# EAGLE design grizzly_bear (EAGLE 6.5.0)
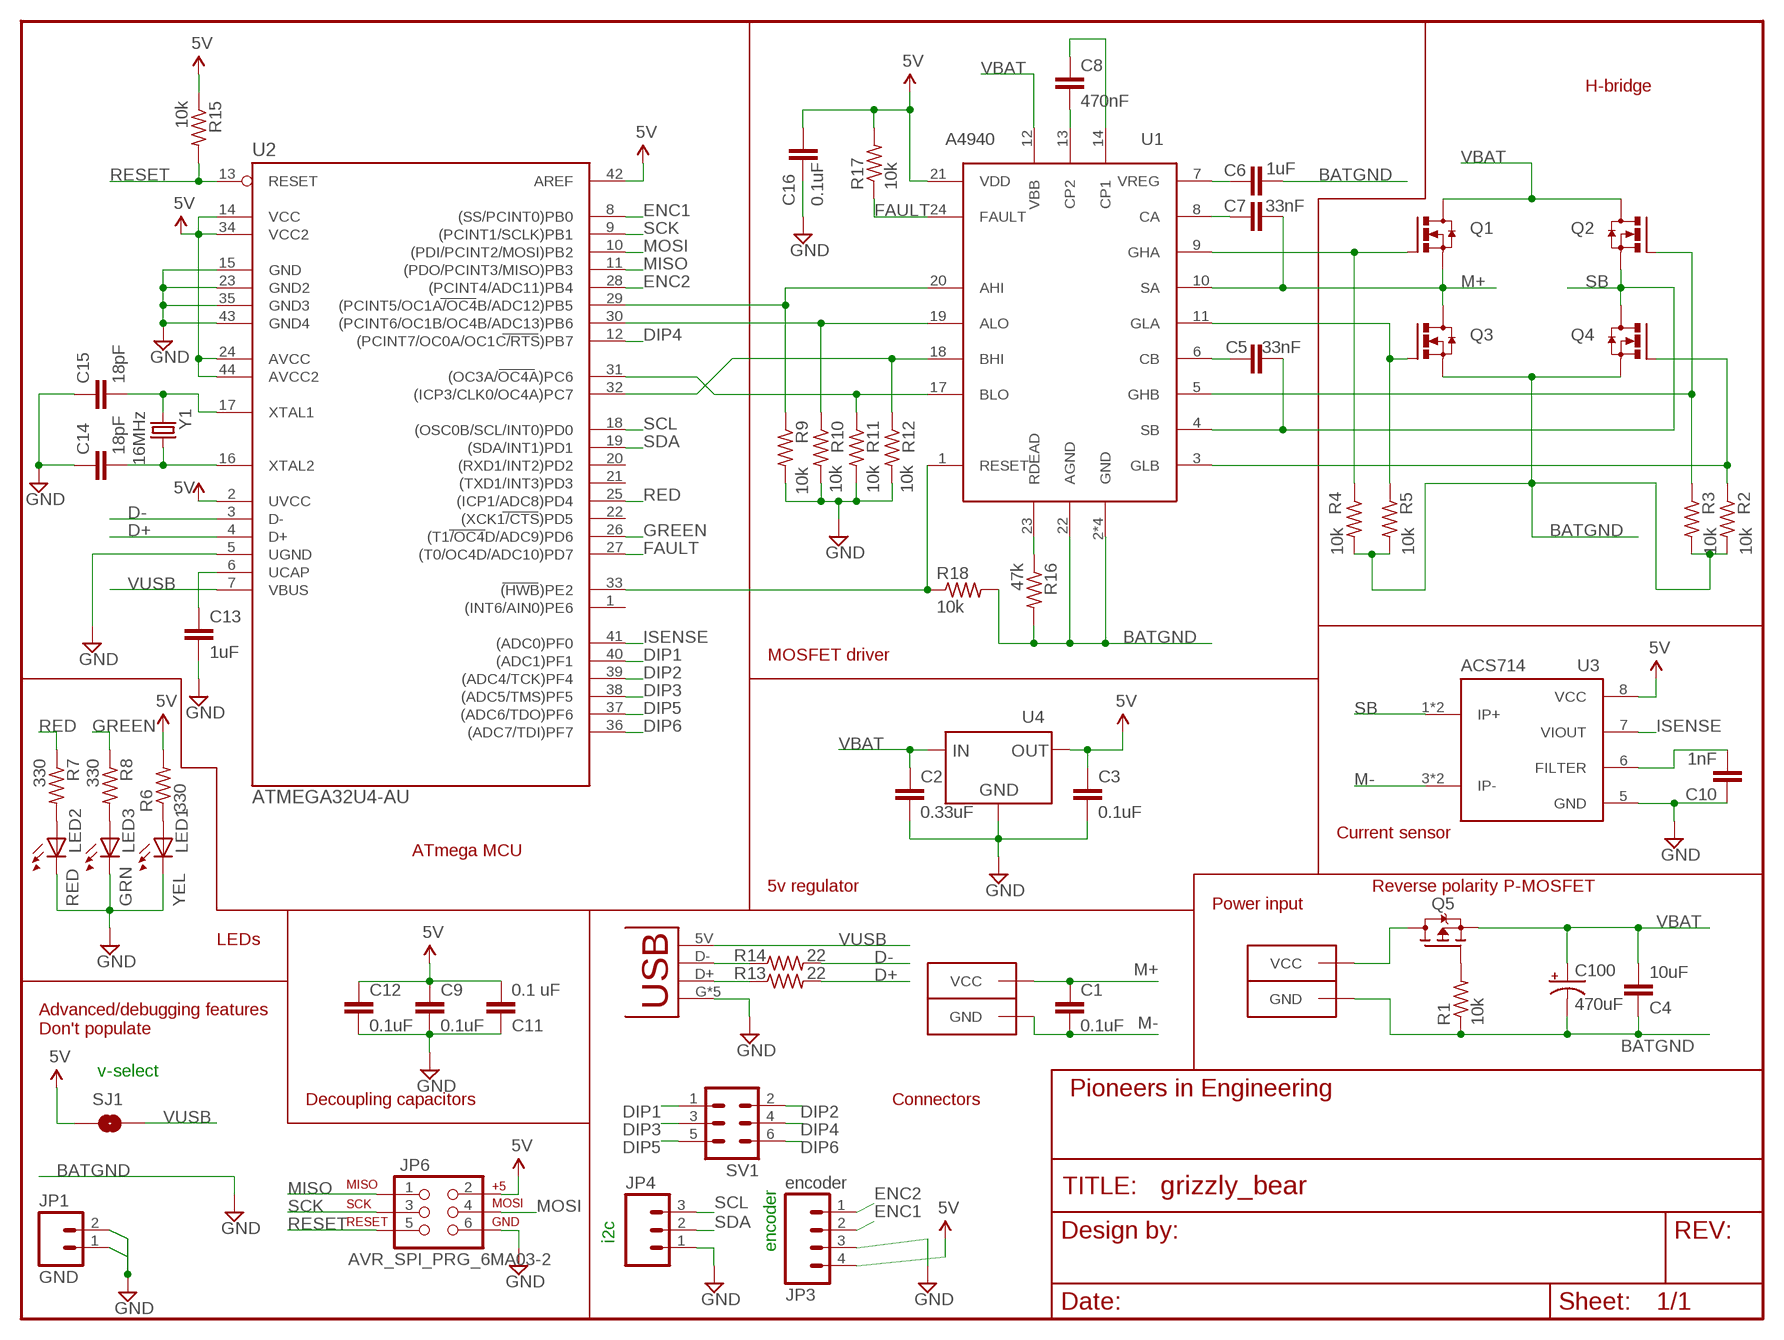
[diagram p0: schematic, sheet 1]
FRAME1 (FRAME-LETTER): AUTHOR: K. Mann, J. Chenn, R. Ou, J. Jacinto; REVISION: B

## Parts
C1  0.1uF  CAP0603-CAP  [0603-CAP]
C2  0.33uF  CAP0603-CAP  [0603-CAP]
C3  0.1uF  CAP0603-CAP  [0603-CAP]
C4  10uF  CAP0603-CAP  [0603-CAP]
C5  33nF  CAP0603-CAP  [0603-CAP]
C6  1uF  CAP0603-CAP  [0603-CAP]
C7  33nF  CAP0603-CAP  [0603-CAP]
C8  470nF  CAP0603-CAP  [0603-CAP]
C9  0.1uF  CAP0603-CAP  [0603-CAP]
C10  1nF  CAP0603-CAP  [0603-CAP]
C11  0.1 uF  CAP0603-CAP  [0603-CAP]
C12  0.1uF  CAP0603-CAP  [0603-CAP]
C13  1uF  CAP0603-CAP  [0603-CAP]
C14  18pF  CAP0603-CAP  [0603-CAP]
C15  18pF  CAP0603-CAP  [0603-CAP]
C16  0.1uF  CAP0603-CAP  [0603-CAP]
C100  470uF  CAP_POLG  [PANASONIC_G]
JP1  GND  M02PTH  [1X02]
JP3  encoder  M041X04-MTA  [1X04-MTA]
JP4  M031X03-MTA  [1X03-MTA]
JP6  AVR_SPI_PRG_6MA03-2  [MA03-2]
LED1  YEL  LED0805  [LED-0805]
LED2  RED  LED0805  [LED-0805]
LED3  GRN  LED0805  [LED-0805]
Q1  N-CHANNEL-MOSFET  [SOT669]
Q2  N-CHANNEL-MOSFET  [SOT669]
Q3  N-CHANNEL-MOSFET  [SOT669]
Q4  N-CHANNEL-MOSFET  [SOT669]
Q5  IPD90P03P4L  P-CHANNEL-MOSFETTO252  [TO252]
R1  10k  R-US_R0603  [R0603]
R2  10k  R-US_R0603  [R0603]
R3  10k  R-US_R0603  [R0603]
R4  10k  R-US_R0603  [R0603]
R5  10k  R-US_R0603  [R0603]
R6  330  R-US_R0603  [R0603]
R7  330  R-US_R0603  [R0603]
R8  330  R-US_R0603  [R0603]
R9  10k  R-US_R0603  [R0603]
R10  10k  R-US_R0603  [R0603]
R11  10k  R-US_R0603  [R0603]
R12  10k  R-US_R0603  [R0603]
R13  22  R-US_R0603  [R0603]
R14  22  R-US_R0603  [R0603]
R15  10k  R-US_R0603  [R0603]
R16  47k  R-US_R0603  [R0603]
R17  10k  R-US_R0603  [R0603]
R18  10k  R-US_R0603  [R0603]
SJ1  SOLDERJUMPERNO  [SJ_2S-NO]
SV1  MA03-2  [MA03-2]
U1  A4940  [24-PIN_TSSOP]
U2  ATMEGA32U4-AU  [TQFP44]
U3  ACS714  [8-PIN_SOIC]
U4  UA78L00  [SOT-89-3]
U$2  USB-M26FTR  [USB-M26FTR]
U$18  ANDERSONVERTICAL  [ANDERSON_VERTICAL]
U$19  ANDERSONVERTICAL  [ANDERSON_VERTICAL]
Y1  16MHz  CRYSTALSMD  [HC49UP]

## Nets
5V: C3.1 C9.1 C11.2 C12.1 C16.1 JP3.4 JP6.2 R6.2 R15.1 R17.2 SJ1.1 U1.21(VDD) U2.2(UVCC) U2.14(VCC) U2.24(AVCC) U2.34(VCC2) U2.42(AREF) U2.44(AVCC2) U3.8(VCC) U4.OUTPUT(OUT)
AHI: R9.1 U1.20(AHI) U2.29((PCINT5/OC1A/OC4B/ADC12)PB5)
ALO: R10.1 U1.19(ALO) U2.30((PCINT6/OC1B/OC4B/ADC13)PB6)
BATGND: C2.2 C3.2 C4.1 C6.2 C9.2 C10.1 C11.1 C12.2 C13.2 C14.1 C15.1 C16.2 C100.- JP1.1 JP1.2 JP3.3 JP4.1 JP6.6 LED1.C LED2.C LED3.C Q3.1(S) Q3.2(S) Q3.3(S) Q4.1(S) Q4.2(S) Q4.3(S) R1.1 R2.2 R3.2 R4.2 R5.2 R9.2 R10.2 R11.2 R12.2 R16.2 R18.2 U1.2(GND) U1.15(GND) U1.16(GND) U1.22(AGND) U1.PAD(GND) U2.5(UGND) U2.15(GND) U2.23(GND2) U2.35(GND3) U2.43(GND4) U3.5(GND) U4.COMMON(GND) U$2.G U$2.S1(G) U$2.S2(G) U$2.S3(G) U$2.S4(G) U$18.PIN1(GND) ; supply symbol labelled GND
BHI: R12.1 U1.18(BHI) U2.32((ICP3/CLK0/OC4A)PC7)
BLO: R11.1 U1.17(BLO) U2.31((OC3A/OC4A)PC6)
CA: C7.1 U1.8(CA)
CB: C5.2 U1.6(CB)
CP1: C8.1 U1.14(CP1)
CP2: C8.2 U1.13(CP2)
D+: R13.2 U2.4(D+)
D+-_CON: R13.1 U$2.D+
D-: R14.2 U2.3(D-)
D-_CON: R14.1 U$2.D-
DIP1: SV1.1 U2.40((ADC1)PF1)
DIP2: SV1.2 U2.39((ADC4/TCK)PF4)
DIP3: SV1.3 U2.38((ADC5/TMS)PF5)
DIP4: SV1.4 U2.12((PCINT7/OC0A/OC1C/RTS)PB7)
DIP5: SV1.5 U2.37((ADC6/TDO)PF6)
DIP6: SV1.6 U2.36((ADC7/TDI)PF7)
DRIVER-RESET: R18.1 U1.1(RESET) U2.33((HWB)PE2)
ENC1: JP3.2 U2.8((SS/PCINT0)PB0)
ENC2: JP3.1 U2.28((PCINT4/ADC11)PB4)
FAULT: R17.1 U1.24(FAULT) U2.27((T0/OC4D/ADC10)PD7)
FILTER: C10.2 U3.6(FILTER)
GHA: Q1.4(G) R4.1 U1.9(GHA)
GHB: Q2.4(G) R3.1 U1.5(GHB)
GLA: Q3.4(G) R5.1 U1.11(GLA)
GLB: Q4.4(G) R2.1 U1.3(GLB)
GREEN: R8.1 U2.26((T1/OC4D/ADC9)PD6)
GREEN-LED: LED3.A R8.2
ISENSE: U2.41((ADC0)PF0) U3.7(VIOUT)
M+: C1.1 C7.2 Q1.1(S) Q1.2(S) Q1.3(S) Q3.MB(D) U1.10(SA) U$19.PIN2(VCC)
M-: C1.2 U3.3(IP-) U3.4(IP-) U$19.PIN1(GND)
MISO: JP6.1 U2.11((PDO/PCINT3/MISO)PB3)
MOSI: JP6.4 U2.10((PDI/PCINT2/MOSI)PB2)
POWER-LED: LED1.A R6.1
RDEAD: R16.1 U1.23(RDEAD)
RED: R7.1 U2.25((ICP1/ADC8)PD4)
RED-LED: LED2.A R7.2
RESET: JP6.5 R15.2 U2.13(RESET)
RPP-GATE: Q5.1(G) R1.2
SB: C5.1 Q2.1(S) Q2.2(S) Q2.3(S) Q4.MB(D) U1.4(SB) U3.1(IP+) U3.2(IP+)
SCK: JP6.3 U2.9((PCINT1/SCLK)PB1)
SCL: JP4.3 U2.18((OSC0B/SCL/INT0)PD0)
SDA: JP4.2 U2.19((SDA/INT1)PD1)
UCAP: C13.1 U2.6(UCAP)
VBAT: C2.1 C4.2 C100.+ Q1.MB(D) Q2.MB(D) Q5.2(S) U1.12(VBB) U4.INPUT(IN)
VIN: Q5.3(D) U$18.PIN2(VCC)
VREG: C6.1 U1.7(VREG)
VUSB: SJ1.2 U2.7(VBUS) U$2.5V
XTAL1: C15.2 U2.17(XTAL1) Y1.2
XTAL2: C14.2 U2.16(XTAL2) Y1.1
Unconnected: U2.1((INT6/AIN0)PE6) U2.20((RXD1/INT2)PD2) U2.21((TXD1/INT3)PD3) U2.22((XCK1/CTS)PD5)

## Notes on the sheet
- H-bridge
- MOSFET driver
- Current sensor
- ATmega MCU
- 5v regulator | Reverse polarity P-MOSFET
- Power input
- LEDs
- Advanced/debugging features
  Don't populate
- v-select
- Decoupling capacitors | Connectors
- i2c
- encoder

## Library data of the parts
C1-C16 = pie:CAP: Capacitor Standard 0603 ceramic capacitor, and 0.1" leaded capacitor.
C100 = pie:CAP_POL: Capacitor Polarized These are standard SMD and PTH capacitors. Normally 10uF, 47uF, and 100uF in electrolytic and tantalum varieties. Always verify the external diameter of the through hole cap, it varies with capacity, voltage, and manufacturer. The EIA devices should be standard.
JP1 = pie:M02: 2-pin 0.1-inch header and MTA connector
JP3 = pie:M04: 4-pin 0.1-inch header and MTA connector; PARTNUMBER: A1922-ND
JP4 = pie:M03: 3-pin 0.1-inch header and MTA connector; PARTNUMBER: A19470-ND
JP6 = pie:AVR_SPI_PRG_6: AVR ISP 6 Pin This is the reduced ISP connector for AVR programming. Common on Arduino. This footprint will take up less PCB space and can be used with a 10-pin to 6-pin adapter such as SKU: BOB-08508
LED1-LED3 = pie:LED: LEDs Standard schematic elements and footprints for 5mm, 3mm, 1206, and 0603 sized LEDs. 5mm - Spark Fun Electronics SKU : COM-00529 (and others)
Q1-Q4 = pie:N-CHANNEL-MOSFET: N-channel TrenchMOS (TM) logic level FET Source: http://www.nxp.com/acrobat_download/datasheets/PH7030L_4.pdf; PIE-DIGIKEY-PN-PRI: 568-6738-1-ND
Q5 = pie:P-CHANNEL-MOSFET: P-Channel PowerTrench® MOSFET Source: FDD4141.pdf; PIE-DIGIKEY-PN-PRI: IPD90P03P4L-04INCT-ND
R1-R18 = pie:R-US_: RESISTOR, American symbol
SJ1 = pie:SOLDERJUMPER: Solder Jumper Standard SMD solder jumper. Used to automate production. Two varients : Normally Open and Normally Closed are the same, but have different paste layers. NC will have a large amount of paste and should jumper during reflow.
SV1 = pie:MA03-2: PIN HEADER; OC_FARNELL: unknown; OC_NEWARK: unknown
U1 = pie:A4940; PIE-DIGIKEY-PN-PRI: 620-1319-1-ND
U2 = pie:ATMEGA32U4-AU; PIE-DIGIKEY-PN-ALT1: ATMEGA32U4-MURCT-ND; PIE-DIGIKEY-PN-PRI: ATMEGA32U4RC-MURCT-ND
U3 = pie:ACS714; PIE-DIGIKEY-PN-PRI: 620-1260-1-ND
U4 = pie:UA78L00; PIE-DIGIKEY-PN-PRI: 296-11118-1-ND
U$2 = pie:USB-M26FTR
U$18 U$19 = pie:ANDERSON: 2-pin 25A Anderson Connector http://www.alliedelec.com/images/products/datasheets/bm/ANDERSON_POWER_PRODUCTS/70162018.pdf; PARTNUMBER: 1377G3
Y1 = pie:CRYSTAL: Various standard crystals. Proven footprints. Spark Fun Electronics SKU : COM-00534

## Board
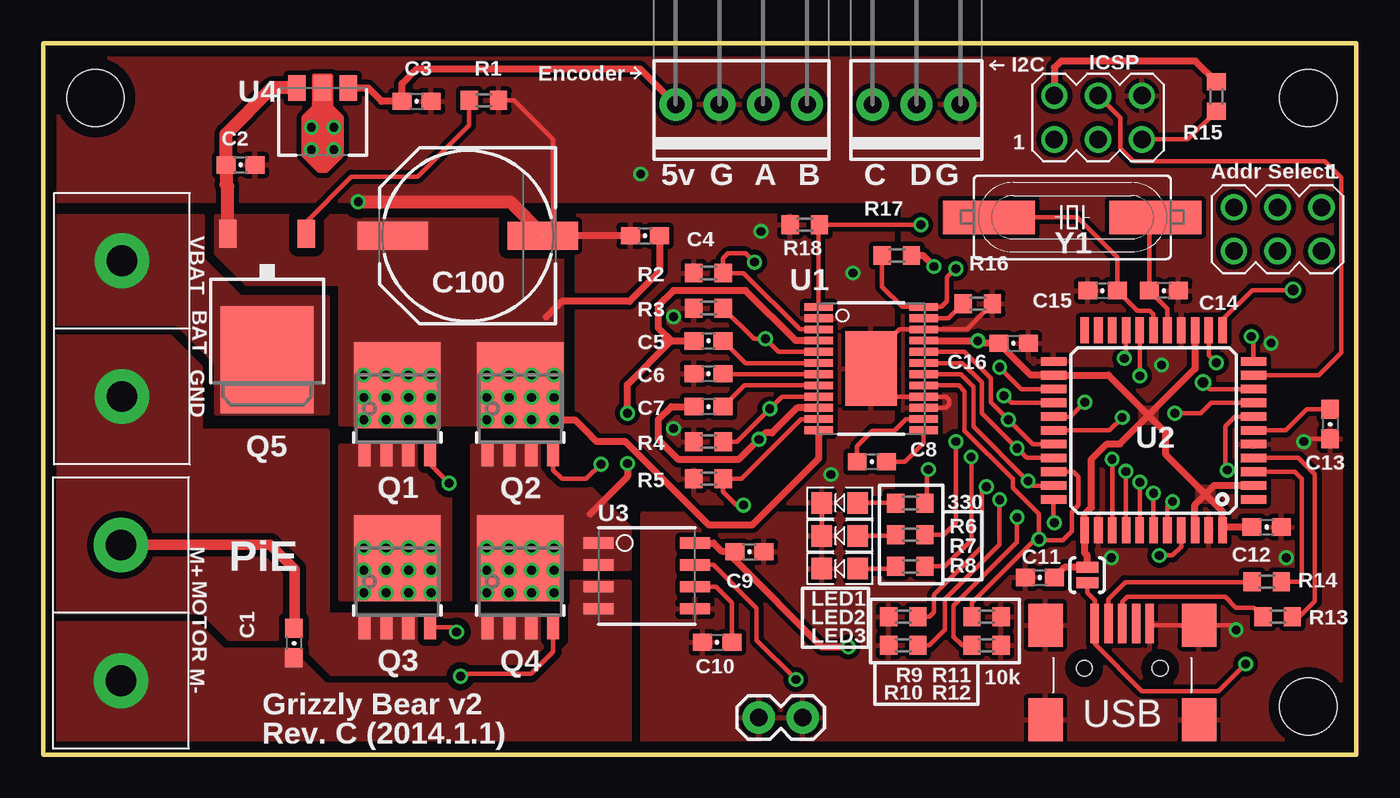
[diagram p1: board, top side]
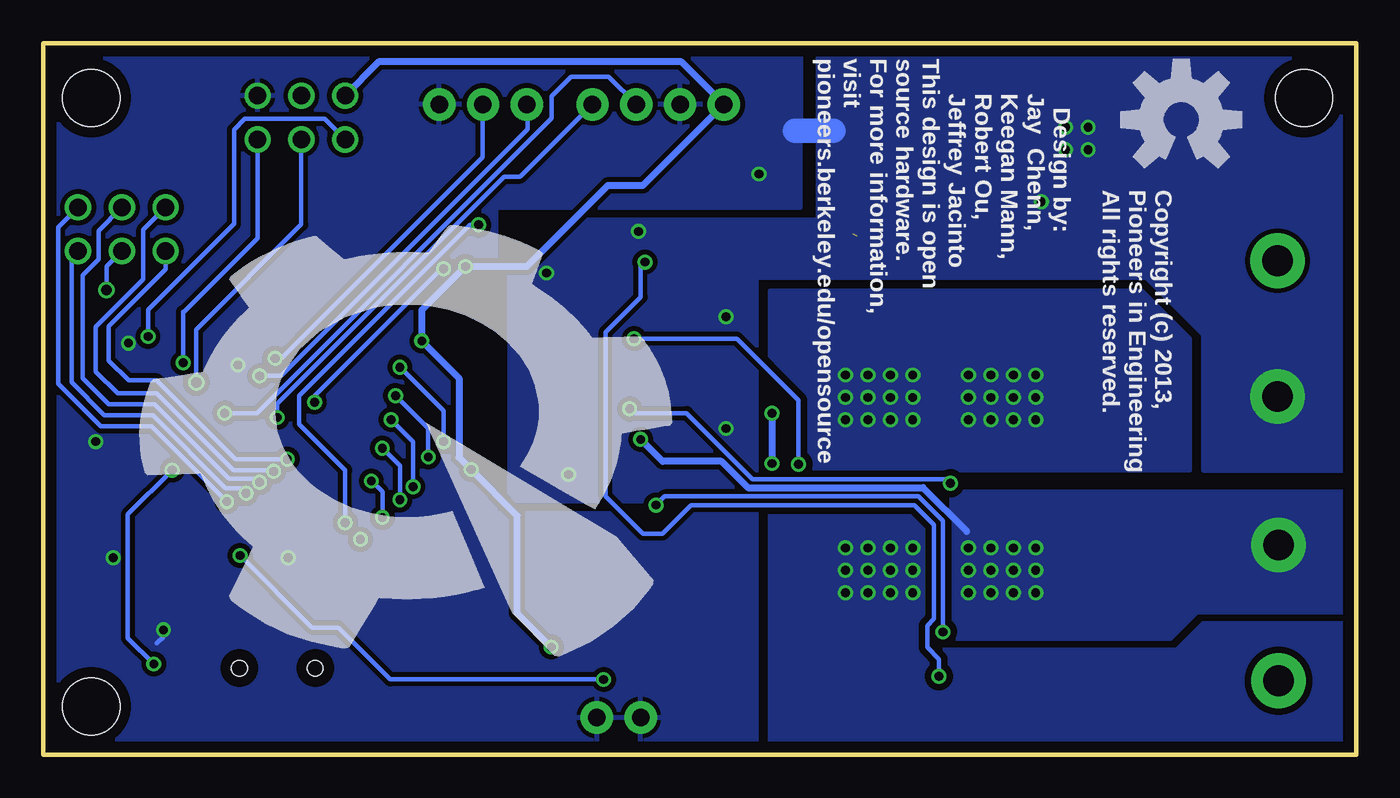
[diagram p2: board, bottom side, seen from below]

Size 76.2 x 41.27 mm. Coordinates in mm from the lower left corner, seen from the top.
Outline: 0,0 76.2,0 76.2,41.27 0,41.27 0,0
Copper layers (1*16): Top 2mil / dielectric 9mil / Bottom 2mil
Design rules "advancedcircuits-33each-pie": minimum track width 6mil, minimum drill 15mil, track to track 6mil, track to pad 10mil, pad to pad 6mil, via to via 6mil, smd to smd 6mil, copper to edge 25mil, drill to drill 7mil, minimum pad ring 7mil, minimum via ring 7mil, stop-mask expansion 3mil, vias tented up to drill 0mil, thermal gap 10mil
tRestrict: area 50.9,20.4 to 51.4,20.5

### Footprints (pad centres in the part's own frame; a part is rotated, then mirrored left to right if it is on the bottom)
0603-CAP = smd 1.1 x 1: 1 -0.85,0; 2 0.85,0
PANASONIC_G = smd 4.1 x 1.6: + 4.35,0; - -4.35,0
1X02 = drill 1.016 pad 1.88: 1 -1.27,0; 2 1.27,0
1X04-MTA = drill 1.016 pad 1.88: 1 -3.81,0; 2 -1.27,0; 3 1.27,0; 4 3.81,0
1X03-MTA = drill 1.016 pad 1.88: 1 -2.54,0; 2 0,0; 3 2.54,0
MA03-2 = drill 1.016 pad 1.524: 1 -2.54,-1.27; 2 -2.54,1.27; 3 0,-1.27; 4 0,1.27; 5 2.54,-1.27; 6 2.54,1.27
LED-0805 = smd 1.194 x 1.245: A -1.041,0; C 1.041,0
SOT669 = smd 0.7 x 1.4: 1 -1.905,-2.65; 2 -0.635,-2.65; 3 0.635,-2.65; 4 1.905,-2.65 | smd 5 x 5: MB 0,1.35
TO252 = smd 1 x 1.6: 1 -2.28,-4.8; 2 2.28,-4.8 | smd 5.4 x 6.2: 3 0,2.5
R0603 = smd 1 x 1.1: 1 -0.85,0; 2 0.85,0
SJ_2S-NO = smd 0.635 x 1.27: 1 -0.45,0; 2 0.45,0
STAND-OFF = hole 3.302: 0,0
24-PIN_TSSOP = smd 1.65 x 0.45: 1 -3.05,3.575; 2 -3.05,2.925; 3 -3.05,2.275; 4 -3.05,1.625; 5 -3.05,0.975; 6 -3.05,0.325; 7 -3.05,-0.325; 8 -3.05,-0.975; 9 -3.05,-1.625; 10 -3.05,-2.275; 11 -3.05,-2.925; 12 -3.05,-3.575; 13 3.05,-3.575; 14 3.05,-2.925; 15 3.05,-2.275; 16 3.05,-1.625; 17 3.05,-0.975; 18 3.05,-0.325; 19 3.05,0.325; 20 3.05,0.975; 21 3.05,1.625; 22 3.05,2.275; 23 3.05,2.925; 24 3.05,3.575 | smd 3 x 4.32: PAD 0,0
TQFP44 = smd 1.5 x 0.5: 1 -5.8,4; 2 -5.8,3.2; 3 -5.8,2.4; 4 -5.8,1.6; 5 -5.8,0.8; 6 -5.8,0; 7 -5.8,-0.8; 8 -5.8,-1.6; 9 -5.8,-2.4; 10 -5.8,-3.2; 11 -5.8,-4; 23 5.8,-4; 24 5.8,-3.2; 25 5.8,-2.4; 26 5.8,-1.6; 27 5.8,-0.8; 28 5.8,0; 29 5.8,0.8; 30 5.8,1.6; 31 5.8,2.4; 32 5.8,3.2; 33 5.8,4 | smd 0.5 x 1.5: 12 -4,-5.8; 13 -3.2,-5.8; 14 -2.4,-5.8; 15 -1.6,-5.8; 16 -0.8,-5.8; 17 0,-5.8; 18 0.8,-5.8; 19 1.6,-5.8; 20 2.4,-5.8; 21 3.2,-5.8; 22 4,-5.8; 34 4,5.8; 35 3.2,5.8; 36 2.4,5.8; 37 1.6,5.8; 38 0.8,5.8; 39 0,5.8; 40 -0.8,5.8; 41 -1.6,5.8; 42 -2.4,5.8; 43 -3.2,5.8; 44 -4,5.8
8-PIN_SOIC = smd 1.75 x 0.65: 1 -2.8,1.905; 2 -2.8,0.635; 3 -2.8,-0.635; 4 -2.8,-1.905; 5 2.8,-1.905; 6 2.8,-0.635; 7 2.8,0.635; 8 2.8,1.905
SOT-89-3 = smd 1 x 1.5: COMMON 0,-3.9; INPUT 1.5,-3.9; OUTPUT -1.5,-3.9
USB-M26FTR = smd 0.5 x 2.3: 5V -1.6,0; D+ 0,0; D- -0.8,0; G 1.6,0; NC 0.8,0 | smd 2 x 2.5: S1 4.45,-0.1; S2 4.45,-5.6; S3 -4.45,-0.1; S4 -4.45,-5.6 | hole 0.9: 2.2,-2.6; -2.2,-2.6
ANDERSON_VERTICAL = drill 1.778 pad 3.175: PIN1 0,-3.937; PIN2 0,3.937
HC49UP = smd 5.334 x 1.93: 1 -4.826,0; 2 4.826,0

### Placement (x,y rotation side)
C1  14.55,6.48 270 top
C2  11.46,34.21 0 top
C3  21.67,37.9 0 top
C4  34.92,30.1 0 top
C5  38.61,24 0 top
C6  38.61,22.1 180 top
C7  38.61,20.19 180 top
C8  48.08,17 0 top
C9  40.99,11.77 0 top
C10  39.11,6.52 0 top
C11  57.83,10.28 0 top
C12  70.99,13.21 0 top
C13  74.68,19.18 270 top
C14  65.02,26.92 180 top
C15  61.47,26.92 0 top
C16  56.31,23.86 0 top
C100  24.64,30.1 180 top
JP1  42.8,2.16 180 top
JP3  40.51,37.72 180 top
JP4  50.67,37.72 180 top
JP6  61.21,36.96 0 top
LED1  46.23,14.61 180 top
LED2  46.23,12.7 180 top
LED3  46.23,10.79 180 top
Q1  20.56,20.07 0 top
Q2  27.69,20.07 0 top
Q3  20.56,10.04 0 top
Q4  27.69,10.04 0 top
Q5  13,25.42 180 top
R1  25.57,37.96 180 top
R2  38.61,27.94 180 top
R3  38.61,25.91 180 top
R4  38.61,18.16 180 top
R5  38.61,16 180 top
R6  50.32,14.6 0 top
R7  50.32,12.76 180 top
R8  50.32,10.92 180 top
R9  49.91,8 180 top
R10  49.91,6.35 180 top
R11  54.74,8 0 top
R12  54.74,6.35 0 top
R13  71.63,8 0 top
R14  70.99,10.03 0 top
R15  68.07,38.18 270 top
R16  54.23,26.16 0 top
R17  49.53,28.96 0 top
R18  44.2,30.73 180 top
SJ1  60.58,10.41 270 top
STANDOFF1  STAND-OFF  [STAND-OFF]  3.05,38.1 0 top
STANDOFF2  STAND-OFF  [STAND-OFF]  73.41,2.79 0 top
STANDOFF3  STAND-OFF  [STAND-OFF]  73.41,38.1 0 top
SV1  71.63,30.48 180 top
U1  48.04,22.39 0 top
U2  64.43,18.81 180 top
U3  35.02,10.37 0 top
U4  16.22,34.77 180 top
U$1  [OSHW-LOGO-L]  10.16,36.83 0 bottom
U$2  62.61,7.62 0 top
U$17  [PIE-LOGO]  54.1,19.05 0 bottom
U$18  4.57,24.71 0 top
U$19  4.52,8.23 0 top
Y1  59.72,31.17 180 top

### Tracks (layer width: path | path; a pad name or v marks a point on that pad's centre or on a via)
5V  (via drill 0.51)
  Top 0.254: R6.2 51.29,14.6 51.29,16.47 v51.36,16.55
  Top 0.406: 46.82,6.35 v46.72,6.25 45.19,6.25 40.14,11.3 C9.1 40.1,11.81 39.37,11.81 38.91,12.28 U3.8 | 64.14,19.68 61.81,22.01 U2.24 57.31,22.01 C16.1 54.37,23.86 v54.23,24 54.21,24.02 U1.21 | U4.OUTPUT 18.86,38.67 19.63,37.9 C3.1 20.82,38.93 21.67,39.78 34.65,39.78 JP3.4 | C11.2 59.27,10.86 SJ1.1 60.58,11.56 60.43,11.71 U2.34 60.43,13.95 60.83,14.35 60.83,17.14 61.72,18.03 62.48,18.03 64.14,19.68 | U2.42 66.83,14.5 67.44,15.11 | 67.44,15.11 65.15,17.4 65.15,18.67 64.14,19.68 | U2.2 67.94,15.61 67.44,15.11 | 67.44,15.11 68.43,14.12 U2.44 68.62,13.21 C12.1 | U2.14 66.83,22.38 64.14,19.68 | R17.2 51.05,28.96 v51.69,28.32 | JP6.2 58.67,39.85 59.05,40.23 66.86,40.23 R15.1
  Bottom 0.406: v46.72,6.25 48.69,8.22 48.69,13.87 v51.36,16.55 | 51.62,16.8 v51.36,16.55 | v51.36,16.55 52.07,17.25 52.07,21.84 v54.23,24 54.23,25.78 v51.69,28.32 48.13,28.32 43.43,33.02 41.4,33.02 JP3.4 39.19,40.21 56.69,40.21 JP6.2
  pour Top: 63.75,20.07 64.52,20.07 64.52,19.3 63.75,19.3
  pour Top: 67.31,15.49 67.82,15.49 67.82,14.73 67.06,14.73 67.06,15.49
AHI  (via drill 0.51)
  Top 0.254: U1.20 53.47,23.37 54.99,21.84 54.99,20.45 v56.01,19.43 57.43,18.01 U2.29 | R9.1 51.44,8 51.69,8.26 51.69,9.27 54.48,12.06 54.48,15.29 v54.74,15.54
  Bottom 0.254: v54.74,15.54 54.74,18.16 v56.01,19.43
ALO  (via drill 0.51)
  Top 0.254: U1.19 53.35,22.72 54.48,21.59 54.48,19.81 v56.52,17.78 57.08,17.21 U2.30 | v55.5,14.78 55.5,12.19 52.32,9.02 52.32,7.24 51.44,6.35 R10.1
  Bottom 0.254: v55.5,14.78 55.5,16.76 v56.52,17.78
BATGND  (via drill 0.51)  (1 unrouted)
  Top 0.254: 29.59,29.98 29.59,35.69 27.32,37.96 R1.1 | U1.15 52.38,20.12 52.58,20.32 52.58,20.57 52.38,20.77 U1.16 48.57,20.77 48.13,21.21 48.13,22.3 U1.PAD 48.9,23.25 48.9,23.88 49.69,24.67 U1.22 53.59,24.67 R16.2 | U$2.G 64.31,7.52 U$2.S1 68.93,7.52 v69.22,7.24 | C13.2 73.44,18.33 73.13,18.01 | v15.57,35.1 v15.57,36.4 v16.87,36.4 | v16.87,35.1 v16.87,36.4 | v16.87,36.4 16.87,36.47 16.51,36.83 16.51,38.38 U4.COMMON | LED1.C LED2.C | 30.5,30.1 C100.-
  Top 0.406: C4.1 30.5,30.1
  Top 0.762: v18.29,32.07 27.11,32.07 28.96,30.23 29.21,30.23 | 29.21,30.23 30.25,30.23 | 29.59,29.98 29.45,29.98 29.21,30.23
  Bottom 0.254: v69.22,7.24 69.22,6.86 69.6,6.48
  Bottom 1.422: 32.59,36.2 30.35,36.2
  other vias: 36.58,25.4 36.58,18.92 41.66,30.35 45.72,16.26 46.99,27.94 64.9,22.61 72.14,11.43 71.25,23.88 73.15,18.16 61.98,11.43 34.67,33.68
  pour Top (isolate 0.381, no thermals): 7.37,24.26 0,24.26 0,8.26 9.27,8.26 10.79,6.73 14.71,6.73 16.74,4.7 27.43,4.7 28.96,6.22 28.96,8.13 16.51,8.13 16.51,18.8 9.14,18.8 9.14,22.48
  pour Top (isolate 0.279): 30.99,31.24 30.99,17.78 34.16,14.61 49.28,14.61 49.28,31.24
  pour Bottom (isolate 0.279, no thermals): 34.8,27.69 12.19,27.69 8.89,24.38 8.89,16.51 0,16.51 0,41.27 31.24,41.27 31.24,30.99 49.15,30.99 49.15,14.73 34.8,14.73
  pour Top (isolate 0.279): 76.2,0 34.8,0 34.8,13.97 49.91,13.97 49.91,32.13 0,32.13 0,41.27 76.2,41.27
  pour Bottom (isolate 0.279): 76.2,0 34.8,0 34.8,13.97 49.91,13.97 49.91,31.75 32.26,31.75 32.23,41.27 76.2,41.27
BHI  (via drill 0.51)
  Top 0.254: U1.18 53.24,22.07 53.98,21.34 53.98,19.05 v57.15,15.88 57.41,15.61 U2.32 | R12.1 53.34,6.35 52.83,6.86 52.83,8.64 56.52,12.32 v56.52,13.77
  Bottom 0.254: v56.52,13.77 56.52,15.24 v57.15,15.88
BLO
  Top 0.254: U1.17 53.13,21.42 53.47,21.08 53.47,18.8 56.26,16 56.26,15.49 57.78,13.97 57.78,12.7 | R11.1 53.89,8.8 57.78,12.7 | 57.78,12.7 58.04,12.45 59.18,12.45 59.69,12.95 59.69,14.1 60.07,14.48 60.07,16.13 59.79,16.41 U2.31
CA
  Top 0.254: U1.8 40.69,21.42 C7.1
CB
  Top 0.254: U1.6 40.74,22.72 C5.2
CP1
  Top 0.254: C8.1 47.23,17.9 48.13,18.8 49.4,18.8 50.08,19.47 U1.14
CP2
  Top 0.254: C8.2 50.02,17 51.09,18.07 U1.13
D+
  Top 0.254: R13.2 72.9,8 73.79,8.89 73.79,16.26 72.83,17.21 U2.4
D+-_CON
  Top 0.254: U$2.D+ 62.61,8.87 62.92,9.17 68.58,9.17 69.22,8.53 70.25,8.53 R13.1
D-
  Top 0.254: U2.3 72.61,16.41 73.03,16 73.03,10.16 72.9,10.03 R14.2
D-_CON
  Top 0.254: U$2.D- 61.81,9.03 62.79,10.01 70.12,10.01 R14.1
DIP1  (via drill 0.51)
  Top 0.254: U2.40 65.23,14.38 v65.53,14.68
  Bottom 0.254: SV1.1 75.31,30.61 75.31,21.51 72.85,19.05 69.9,19.05 v65.53,14.68
DIP2  (via drill 0.51)
  Top 0.254: U2.39 v64.43,15.16
  Bottom 0.254: SV1.2 74.55,28.83 74.55,21.59 72.64,19.68 69.83,19.68 65.61,15.47 64.73,15.47 v64.43,15.16
DIP3  (via drill 0.51)
  Top 0.254: U2.38 v63.63,15.8
  Bottom 0.254: SV1.3 72.97,30.4 72.97,28.75 73.91,27.81 73.91,21.84 72.39,20.32 69.72,20.32 65.41,16 63.83,16 v63.63,15.8
DIP4  (via drill 0.6)
  Top 0.254: U2.12 68.43,25.22 70.16,26.95 v72.52,26.95
  Bottom 0.254: v72.52,26.95 72.52,28.32 SV1.4
DIP5  (via drill 0.51)
  Top 0.254: U2.37 v62.83,16.43
  Bottom 0.254: SV1.5 70.38,30.45 70.38,27.58 73.15,24.82 73.15,22.23 71.88,20.95 69.6,20.95 65.15,16.51 62.9,16.51 v62.83,16.43
DIP6  (via drill 0.51)
  Top 0.254: U2.36 v62.03,17.14
  Bottom 0.254: v62.03,17.14 65.02,17.14 69.6,21.72 71.25,21.72 72.39,22.86 72.39,24.87 69.09,28.17 SV1.6
DRIVER-RESET  (via drill 0.51)
  Top 0.254: U2.33 58.63,13.51 v58.67,13.46 | v50.93,30.73 R18.1 44.99,30.68 U1.1
  Bottom 0.254: v58.67,13.46 58.67,16.51 61.34,19.18 61.34,20.83 51.44,30.73 v50.93,30.73
ENC1  (via drill 0.51)
  Top 0.254: v65.66,19.81 67.18,19.81 67.78,20.41 U2.8
  Bottom 0.254: v65.66,19.81 63.78,19.81 46.69,36.91 46.69,38.2 45.57,39.32 43.38,39.32 JP3.2
ENC2  (via drill 0.51)
  Top 0.254: U2.28 61.87,18.81 v62.61,19.56
  Bottom 0.254: v62.61,19.56 62.61,20.37 49.45,33.53 48.51,33.53 JP3.1
FAULT  (via drill 0.51)
  Top 0.254: U2.27 59.62,19.61 v60.45,20.45 | R17.1 48.68,27.14 49.85,25.97 U1.24 52.13,25.97 52.45,26.29 52.45,27.69 v52.96,28.19
  Bottom 0.254: v60.45,20.45 60.45,20.83 53.09,28.19 v52.96,28.19
FILTER
  Top 0.254: C10.2 39.96,8.8 39.03,9.73 U3.6
GHA  (via drill 0.51)
  Top 0.254: U1.9 42.87,20.77 v42.16,20.07 40.26,18.16 R4.1 | Q1.4 22.46,16.84 v23.55,15.75
  Bottom 0.254: v42.16,20.07 41.91,19.81 38.86,19.81 35.04,15.99 23.79,15.99 v23.55,15.75
GHB  (via drill 0.51)
  Top 0.254: Q2.4 29.6,16.5 30.1,16 31.52,16 v32.37,16.86 | U1.5 42.67,23.37 v41.91,24.13 41.24,24.13 R3.1 39.5,25.91
  Bottom 0.254: v41.91,24.13 35.94,24.13 32.37,20.56 v32.37,16.86
GLA  (via drill 0.51)
  Top 0.254: Q3.4 23.71,7.39 v23.99,7.12 | U1.11 43.98,19.47 40.51,16 R5.1 39.46,15.24 40.22,14.48 v40.64,14.48
  Bottom 0.254: v23.99,7.12 23.99,13.58 25.4,14.99 40.13,14.99 v40.64,14.48
GLB  (via drill 0.51)
  Top 0.254: U1.3 43.91,24.67 40.64,27.94 R2.1 39.46,28.79 39.75,29.08 40.77,29.08 v41.27,28.57 | Q4.4 29.6,5.97 28.32,4.7 24.37,4.7 v24.22,4.55
  Bottom 0.254: v24.22,4.55 24.22,5.55 24.89,6.22 24.89,7.49 24.51,7.87 24.51,13.34 25.65,14.48 38.61,14.48 40.26,12.83 41.4,12.83 43.56,14.99 43.56,24.51 41.53,26.54 41.53,28.32 v41.27,28.57
GREEN  (via drill 0.51)
  Top 0.254: 58.84,20.41 U2.26 56.17,20.41 v55.75,20.83 | R8.1 52.32,10.92 53.85,12.45 v53.85,17.27
  Bottom 0.254: v53.85,17.27 53.85,18.92 v55.75,20.83
GREEN-LED
  Top 0.254: LED3.A 49.34,10.79 R8.2
ISENSE  (via drill 0.51)
  Top 0.254: U3.7 38.91,11.01 41.4,8.51 41.4,6.64 v43.68,4.37 | U2.41 66.03,12.05 65.53,11.56 v64.77,11.56
  Bottom 0.254: v43.68,4.37 56.06,4.37 59.05,7.37 60.58,7.37 v64.77,11.56
M+  (via drill 0.51)
  Top 0.406: U1.10 43.74,20.12 42.29,18.67 41.91,18.67 v41.53,18.29 40.39,17.14 36.83,17.14 35.69,18.29 35.69,19.43 36.45,20.19 C7.2
  Top 0.61: U$19.PIN2 13.18,12.17 14.61,10.74 14.61,7.38 C1.1
  Bottom 0.406: 22.61,12.95 25.15,15.49 35.31,15.49 36.83,17.02 40.26,17.02 v41.53,18.29
  other vias: 19.91,9.39 21.21,9.39 22.51,9.39 18.61,10.7 19.91,10.7 21.21,10.7 22.51,10.7 18.61,11.99 19.91,11.99 21.21,11.99 22.51,11.99 18.61,9.39
  pour Top (isolate 0.381, no thermals): 17.27,17.91 17.27,9.02 23.62,9.02 23.62,17.91
  pour Bottom (isolate 0.381, no thermals): 23.5,15.24 0,15.24 0,8.26 9.27,8.26 10.79,6.73 23.5,6.73
M-
  pour Top (isolate 0.381, no thermals): 0,7.62 8.89,7.62 10.41,6.1 14.33,6.1 16.36,4.06 28.19,4.06 30.61,6.48 30.61,10.03 34.04,10.03 34.04,0 0,0
MISO  (via drill 0.51)
  Top 0.254: U2.11 70.23,24.13 v70.1,24.26
  Bottom 0.254: v70.1,24.26 70.1,25.81 65.13,30.79 65.13,36.25 64.49,36.88 59.87,36.88 JP6.1
MOSI
  Top 0.254: JP6.4 62.51,36.93 62.51,35.18 63.27,34.42 74.37,34.42 75.31,33.48 75.31,23.32 74.01,22.01 U2.10
N$3  (via drill 0.51)
  other vias: 57.78,12.5
POWER-LED
  Top 0.254: LED1.A 49.45,14.61 R6.1
RDEAD
  Top 0.254: U1.23 52.54,25.32 R16.1
RED  (via drill 0.51)
  Top 0.254: 51.16,12.68 R7.1 52.25,12.76 52.96,13.46 v52.96,18.16 | U2.25 56.77,21.21 v55.5,22.48
  Bottom 0.254: v55.5,22.48 52.96,19.94 v52.96,18.16
RED-LED
  Top 0.254: LED2.A 49.41,12.7 R7.2
RESET  (via drill 0.51)
  Top 0.254: U2.13 67.63,23.18 v68.07,22.73 | JP6.5 66.43,35.69 R15.2
  Bottom 0.254: v68.07,22.73 68.07,25.68 68.02,25.68 63.75,29.95 JP6.5
RPP-GATE
  Top 0.254: R1.2 24.71,37.95 24.71,36.5 21.74,33.53 17.88,33.53 15.28,30.93 Q5.1
SB  (via drill 0.51)
  Top 0.406: U1.4 43.67,24.02 40.77,26.92 36.58,26.92 35.69,26.04 35.69,24.77 36.45,24 | 36.45,24 C5.1 | v33.91,16.89 33.91,16.13 31.75,13.97 | v33.91,19.81 33.91,21.46 36.39,23.94 | 36.39,23.94 36.45,24 | 36.07,23.75 36.07,24.26 36.39,23.94
  Bottom 0.406: v33.91,19.81 v33.91,16.89
  other vias: 29.64,11.99 29.64,9.39 25.74,11.99 28.34,11.99 27.04,11.99 25.74,9.39 25.74,10.7 29.64,10.7 28.34,10.7 27.04,10.7 27.04,9.39 28.34,9.39
  pour Top (isolate 0.381, no thermals): 24.89,9.02 24.89,17.91 30.35,17.91 30.35,16.89 34.04,13.21 34.04,10.79 29.97,10.79 29.97,9.02
  pour Bottom (isolate 0.381): 0,7.62 8.89,7.62 10.41,6.1 24.38,6.1 24.38,15.37 34.04,15.37 34.04,0 0,0
SCK  (via drill 0.6)
  Top 0.254: U2.9 67.69,21.21 v67.31,21.59
  Bottom 0.254: v67.31,21.59 67.31,24.66 61.21,30.76 JP6.3
SCL  (via drill 0.51)
  Top 0.254: U2.18 v63.63,21.97
  Bottom 0.254: v63.63,21.97 62.38,21.97 48.08,36.27 48.08,37.67 JP4.3
SDA  (via drill 0.51)
  Top 0.254: v62.74,22.99 62.83,23.08 U2.19
  Bottom 0.254: v62.74,22.99 62.74,23.01 62.33,23.01 50.7,34.65 50.7,37.69 JP4.2
UCAP
  Top 0.254: U2.6 72.1,18.81 73.32,20.03 C13.1
VBAT  (via drill 0.51)
  Top 0.254: 31.49,18.79 31.14,19.14
  Top 0.406: C4.2 35.77,28.03 34.04,26.29 30.1,26.29 29.21,25.4 | v29.64,19.43 30.86,19.43 31.49,18.79 32.12,18.16 33.78,18.16 38.61,13.34 41.15,13.34 44.99,17.18 U1.12 | 10.72,32.97 10.61,33.08
  Top 0.762: 10.61,33.08 C2.1 10.61,36.01 13.27,38.67 U4.INPUT | Q5.2 10.72,32.97
  other vias: 18.61,20.73 19.91,20.73 21.21,20.73 22.51,20.73 18.61,19.43 19.91,19.43 21.21,19.43 22.51,19.43 25.74,22.02 27.04,22.02 28.34,22.02 29.64,22.02 25.74,20.73 27.04,20.73 28.34,20.73 29.64,20.73 18.61,22.02 19.91,22.02 21.21,22.02 22.51,22.02 25.74,19.43 27.04,19.43 28.34,19.43
  pour Top (isolate 0.508, no thermals): 30.1,19.18 17.27,19.18 17.27,27.3 11.81,27.3 10.03,29.08 10.03,31.24 30.1,31.24
  pour Bottom (isolate 0.381): 34.04,16.51 34.04,26.92 12.45,26.92 9.65,24.13 9.65,16.51
VIN
  pour Top (isolate 0.381, no thermals): 0,31.24 0,25.02 7.75,25.02 10.03,22.73 10.03,19.81 16.51,19.81 16.51,26.54 11.43,26.54 9.27,28.7 9.27,31.24
VREG
  Top 0.254: U1.7 39.49,22.07 C6.1
VUSB  (via drill 0.51)
  Top 0.254: SJ1.2 60.58,9.4 61.01,8.97 U$2.5V 61.01,6.43 63.75,3.68 68.19,3.68 v69.77,5.27 | v68.71,16.51 68.58,16.64 68.58,19.05 69.14,19.61 U2.7
  Bottom 0.254: v68.71,16.51 71.28,13.94 71.28,6.77 v69.77,5.27
XTAL1
  Top 0.254: Y1.2 60.02,31.17 62.32,28.87 C15.2 63.49,25.76 64.21,25.76 64.43,25.54 U2.17
XTAL2
  Top 0.254: U2.16 65.23,25.87 C14.2 64.17,30.8 Y1.1

### Text on the board
tPlace: ICSP | Encoder | I2C | 1 | 5v | G | A | B | C | D | G | Addr Select | 1 | VBAT | BAT | GND | 330 | M+ | PiE | MOTOR | M- | 10k | Grizzly Bear v2 | Rev. C (2014.1.1)
bPlace: Design by: / Jay Chenn, / Keegan Mann, / Robert Ou, / Jeffrey Jacinto / This design is open / source hardware. / For more information, / visit / pioneers.berkeley.edu/opensource | Copyright (c) 2013, / Pioneers in Engineering / All rights reserved.
tValues: Q1-Q4 PSMN4R5